# Altium schematic sheet BH67F2752_TEMP_EVM_V1.2.schdoc
size 304 x 228 mm; PageSetup: Record=PageOptions|CenterHorizontal=True|CenterVertical=True|PrintScale=0.87|XCorrection=1.00|YCorrection=1.00|PrintKind=1|BorderSize=5000000|LeftOffset=0|BottomOffset=0|Orientation=2|PaperLength=2970|PaperWidth=2100|Scale=100|PaperSource=7|PrintQuality=600|MediaType=1|DitherType=10|PaperKind=A4|PrintScaleMode=1
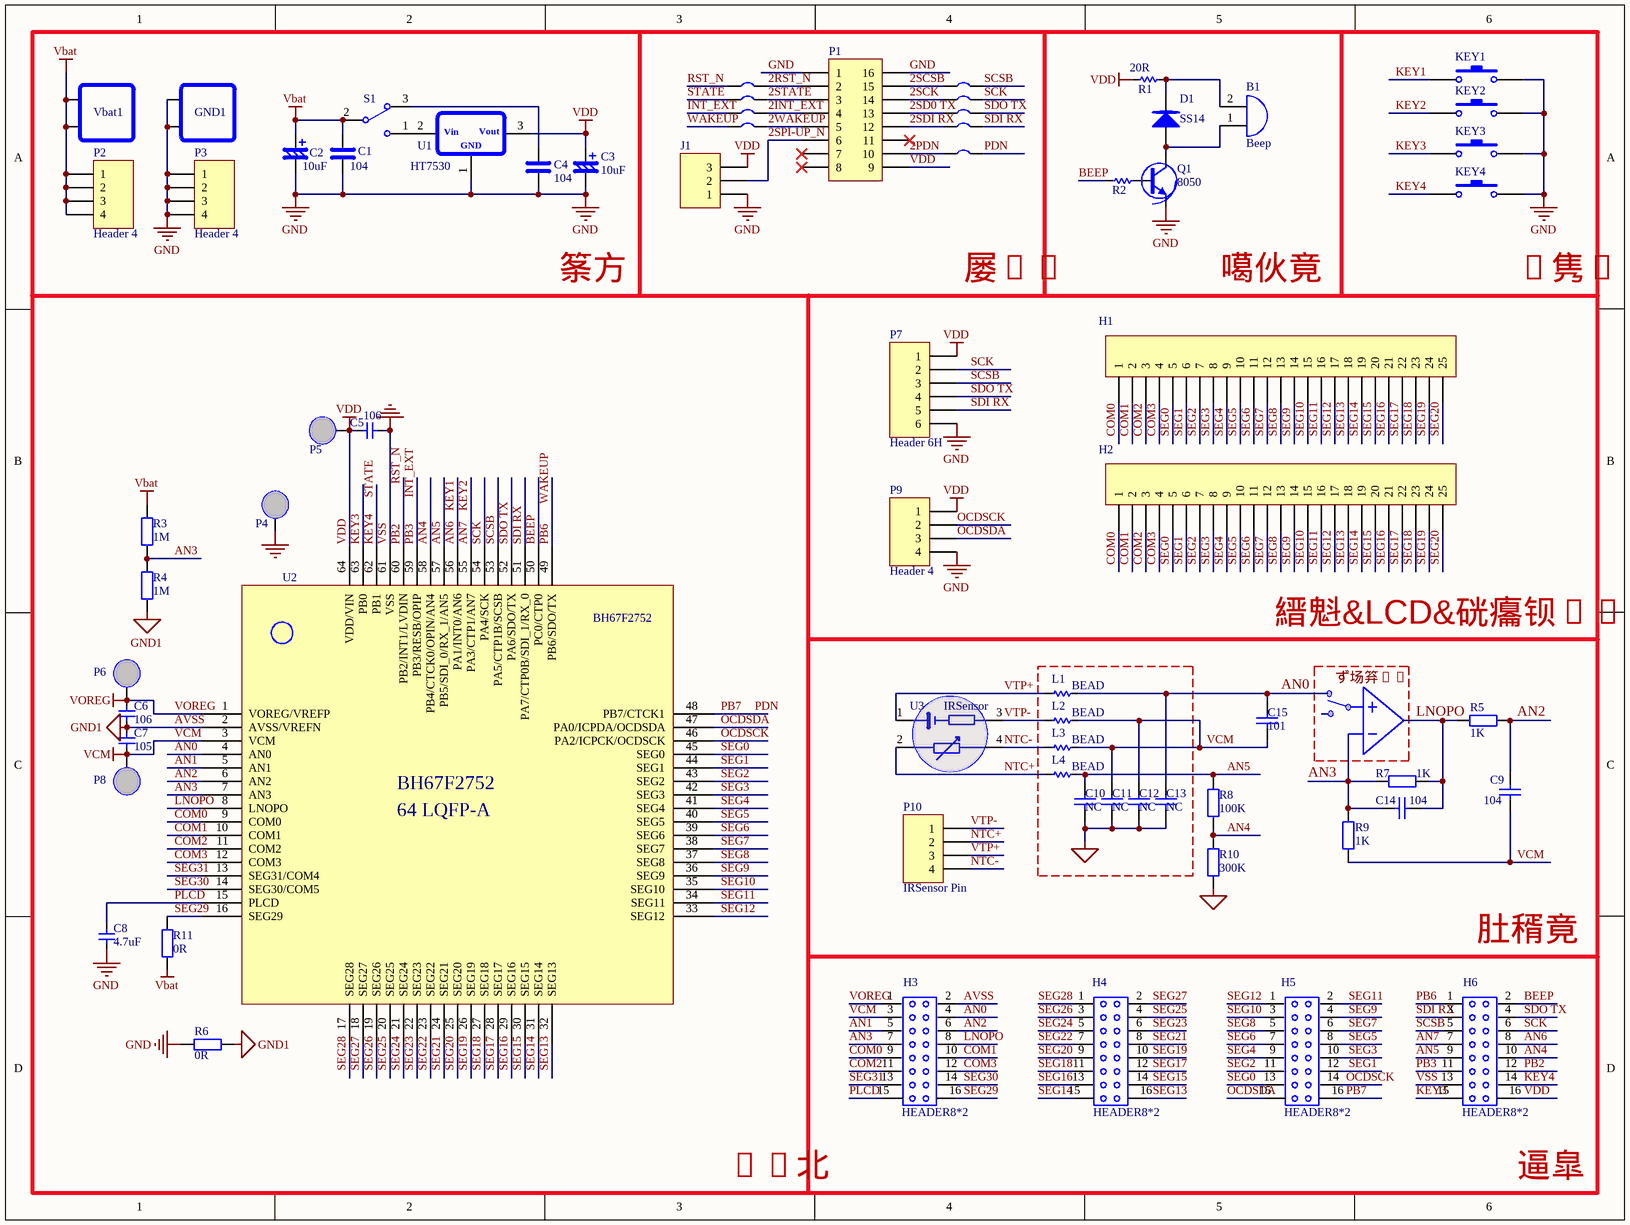
[diagram p0: BH67F2752_TEMP_EVM_V1.2.schdoc]

## Parts
B1  Beep  [BEEP_12mm]
C1  value 104  [C0805]  (hidden comment: CAPACITOR)
C2  Vaule: 10uF  [C0805]  (hidden comment: ECAP)
C3  Vaule: 10uF  [C0805]  (hidden comment: ECAP)
C4  value 104  [C0805]  (hidden comment: CAPACITOR)
C5  106  [CAP_0603]
C6  106  [CAP_0603]
C7  105  [CAP_0603]
C8  4.7uF  [CAP_0603]
C9  104  [CAP_0603]
C10  NC  [CAP_0603]
C11  NC  [CAP_0603]
C12  NC  [CAP_0603]
C13  NC  [CAP_0603]
C14  104  [CAP_0603]
C15  101  [CAP_0603]
D1  SS14  [DIODE]
GND1  CONNET*2  [CLIP POWER PIN]  (value not drawn)  (no BOM)
H1  HEADER36  [Header25(2mm) - duplicate]  (value not drawn)
H2  HEADER36  [Header252.54mm)]  (value not drawn)
H3  HEADER8*2  [HEAD2X8]  (no BOM)
H4  HEADER8*2  [2HEAD2X8]  (no BOM)
H5  HEADER8*2  [3HEAD2X8]  (no BOM)
H6  HEADER8*2  [4HEAD2X8 - duplicate]  (no BOM)
INT_EX1  JUMPER  [JUMP_2]  (value not drawn)  (no BOM)
J1  Header 3  [JUMP_3]  (value not drawn)
KEY1  SW-PB  [AN66]  (value not drawn)
KEY2  SW-PB  [AN66]  (value not drawn)
KEY3  SW-PB  [AN66]  (value not drawn)
KEY4  SW-PB  [AN66]  (value not drawn)
L1  BEAD  [RES_0603]
L2  BEAD  [RES_0603]
L3  BEAD  [RES_0603]
L4  BEAD  [RES_0603]
P1  Header 8X2A  [BC7602]  (value not drawn)
P2  Header 4  [HDR1X4]
P3  Header 4  [HDR1X4]
P4  PAD  [PAD]  (value not drawn)
P5  PAD  [PAD]  (value not drawn)
P6  PAD  [PAD]  (value not drawn)
P7  Header 6H  [HEAD1X6]
P8  PAD  [PAD]  (value not drawn)
P9  Header 4  [HDR1X4]
P10  IRSensor Pin  [HDR1X4]
PDN1  JUMPER  [JUMP_2]  (value not drawn)  (no BOM)
Q1  8050  [SOT-23]
R1  20R  [RES_0603]
R2  1K  [RES_0603]  (value not drawn)
R3  value 1M  [RES_0603]  (hidden comment: RES0603)
R4  value 1M  [RES_0603]  (hidden comment: RES0603)
R5  value 1K  [RES_0603]  (hidden comment: RES0603)
R6  value 0R  [RES_0603]  (hidden comment: RES0603)
R7  value 1K  [RES_0603]  (hidden comment: RES0603)
R8  value 100K  [RES_0603]  (hidden comment: RES0603)
R9  value 1K  [RES_0603]  (hidden comment: RES0603)
R10  value 300K  [RES_0603]  (hidden comment: RES0603)
R11  value 0R  [RES_0603]  (hidden comment: RES0603)
RST_N1  JUMPER  [JUMP_2]  (value not drawn)  (no BOM)
S1  SW-3  [JUMP_3]  (value not drawn)
SCK1  JUMPER  [JUMP_2]  (value not drawn)  (no BOM)
SCS1  JUMPER  [JUMP_2]  (value not drawn)  (no BOM)
SDIRX1  JUMPER  [JUMP_2]  (value not drawn)  (no BOM)
SDOTX1  JUMPER  [JUMP_2]  (value not drawn)  (no BOM)
STATE1  JUMPER  [JUMP_2]  (value not drawn)  (no BOM)
U1  HT7530  [SOT89M]
U2  BH67F2752  [64PIN(LQFP)]
U3  IRSensor  [TS318_115]
Vbat1  CONNET*2  [CLIP POWER PIN]  (value not drawn)  (no BOM)
WAKE1  JUMPER  [JUMP_2]  (value not drawn)  (no BOM)

## Nets
AVSS: C6.2 C7.1 C10.2 C11.2 C12.2 C13.2 H3.2 R4.2 R6.1 R10.2 U2.2(AVSS/VREFN)  [also labelled GND1]
GND: C1.1 C2.2 C3.2 C4.1 C5.1 C8.2 GND1.1 GND1.2 H6.13 J1.1 KEY1.2 KEY2.2 KEY3.2 KEY4.2 P1.1 P1.16 P3.1 P3.2 P3.3 P3.4 P4.1 P7.6 P9.4 Q1.2(E) R6.2 U1.1 U2.61(VSS)  [also labelled VSS]
Vbat: C1.2 C2.1 P2.1 P2.2 P2.3 P2.4 R3.1 S1.2 Vbat1.1 Vbat1.2
VCM: C7.2 C9.1 C11.1 C12.1 C15.2 H3.3 L2.2 L3.2 P8.1 R9.1 U2.3(VCM)
VDD: C3.1 C5.2 H6.16 J1.3 P1.9 P5.1 P7.1 P9.1 R1.2 U1.3 U2.64(VDD/VIN)
VOREG: C6.1 H3.1 P6.1 U2.1(VOREG/VREFP)
2INT_EXT: INT_EX1.2 P1.4
2PDN: P1.10 PDN1.2
2RST_N: P1.2 RST_N1.2
2SCK: P1.14 SCK1.2
2SCSB: P1.15 SCS1.2
2SD0 TX: P1.13 SDOTX1.2
2SDI RX: P1.12 SDIRX1.2
2SPI-UP_N: J1.2 P1.6
2STATE: P1.3 STATE1.2
2WAKEUP: P1.5 WAKE1.2
AN0: C13.1 C15.1 H3.4 L1.2 U2.4(AN0)
AN1: H3.5 U2.5(AN1)
AN2: C9.2 H3.6 R5.2 U2.6(AN2)
AN3: C14.2 H3.7 R3.2 R4.1 R7.1 R9.2 U2.7(AN3)
AN4: H6.10 R8.2 R10.1 U2.58(PB4/CTCK0/OPIN/AN4)
AN5: C10.1 H6.9 L4.2 R8.1 U2.57(PB5/SDI_0/RX_1/AN5)
AN6: H6.8 KEY1.1 U2.56(PA1/INT0/AN6)  [also labelled KEY1]
AN7: H6.7 KEY2.1 U2.55(PA3/CTP1/AN7)  [also labelled KEY2]
BEEP: H6.2 R2.1 U2.50(PC0/CTP0)
COM0: H1.1 H2.1 H3.9 U2.9(COM0)
COM1: H1.2 H2.2 H3.10 U2.10(COM1)
COM2: H1.3 H2.3 H3.11 U2.11(COM2)
COM3: H1.4 H2.4 H3.12 U2.12(COM3)
INT_EXT: H6.11 INT_EX1.1 U2.59(PB3/RESB/OPIP)  [also labelled PB3]
KEY3: H6.15 KEY3.1 U2.63(PB0)
KEY4: H6.14 KEY4.1 STATE1.1 U2.62(PB1)  [also labelled STATE]
LNOPO: C14.1 H3.8 R5.1 R7.2 U2.8(LNOPO)
NTC+: L4.1 P10.2 U3.2
NTC-: L3.1 P10.4 U3.4
OCDSCK: H5.14 P9.2 U2.46(PA2/ICPCK/OCDSCK)
OCDSDA: H5.15 P9.3 U2.47(PA0/ICPDA/OCDSDA)
PB2: H6.12 RST_N1.1 U2.60(PB2/INT1/LVDIN)  [also labelled RST_N]
PB6: H6.1 U2.49(PB6/SDO/TX) WAKE1.1  [also labelled WAKEUP]
PB7: H5.16 PDN1.1 U2.48(PB7/CTCK1)  [also labelled PDN]
PLCD: C8.1 H3.15 U2.15(PLCD)
SCK: H6.6 P7.2 SCK1.1 U2.54(PA4/SCK)
SCSB: H6.5 P7.3 SCS1.1 U2.53(PA5/CTP1B/SCSB)
SDI RX: H6.3 P7.5 SDIRX1.1 U2.51(PA7/CTP0B/SDI_1/RX_0)
SDO TX: H6.4 P7.4 SDOTX1.1 U2.52(PA6/SDO/TX)
SEG0: H1.5 H2.5 H5.13 U2.45(SEG0)
SEG1: H1.6 H2.6 H5.12 U2.44(SEG1)
SEG2: H1.7 H2.7 H5.11 U2.43(SEG2)
SEG3: H1.8 H2.8 H5.10 U2.42(SEG3)
SEG4: H1.9 H2.9 H5.9 U2.41(SEG4)
SEG5: H1.10 H2.10 H5.8 U2.40(SEG5)
SEG6: H1.11 H2.11 H5.7 U2.39(SEG6)
SEG7: H1.12 H2.12 H5.6 U2.38(SEG7)
SEG8: H1.13 H2.13 H5.5 U2.37(SEG8)
SEG9: H1.14 H2.14 H5.4 U2.36(SEG9)
SEG10: H1.15 H2.15 H5.3 U2.35(SEG10)
SEG11: H1.16 H2.16 H5.2 U2.34(SEG11)
SEG12: H1.17 H2.17 H5.1 U2.33(SEG12)
SEG13: H1.18 H2.18 H4.16 U2.32(SEG13)
SEG14: H1.19 H2.19 H4.15 U2.31(SEG14)
SEG15: H1.20 H2.20 H4.14 U2.30(SEG15)
SEG16: H1.21 H2.21 H4.13 U2.29(SEG16)
SEG17: H1.22 H2.22 H4.12 U2.28(SEG17)
SEG18: H1.23 H2.23 H4.11 U2.27(SEG18)
SEG19: H1.24 H2.24 H4.10 U2.26(SEG19)
SEG20: H1.25 H2.25 H4.9 U2.25(SEG20)
SEG21: H4.8 U2.24(SEG21)
SEG22: H4.7 U2.23(SEG22)
SEG23: H4.6 U2.22(SEG23)
SEG24: H4.5 U2.21(SEG24)
SEG25: H4.4 U2.20(SEG25)
SEG26: H4.3 U2.19(SEG26)
SEG27: H4.2 U2.18(SEG27)
SEG28: H4.1 U2.17(SEG28)
SEG29: H3.16 R11.2 U2.16(SEG29)
SEG30: H3.14 U2.14(SEG30/COM5)
SEG31: H3.13 U2.13(SEG31/COM4)
VTP+: L1.1 P10.3 U3.1
VTP-: L2.1 P10.1 U3.3
NetB1_1: B1.1 D1.1(A) Q1.3(C)
NetB1_2: B1.2 D1.2(K) R1.1
NetC4_2: C4.2 S1.3
NetQ1_1: Q1.1(B) R2.2
NetS1_1: S1.1 U1.2

Not connected (* = marked no-connect by the designer): P1 7* 8* 11*; R11 1

## Notes on the sheet
- 筿方
- 屡��
- 噶伙竟
- �隽�
- 縉魁&LCD&硄癟钡�f
- ず场笲��
- 肚稰竟
- �D北
- (near H6) 逼皐
- Labels drawn without touching a wire or pin: Vbat
- (in symbol BH67F2752) 64 LQFP-A
- (in symbol LDO) Vin; Vout; GND

## Library data of the parts
C2 C3 = ECAP: Capacitor
C5-C8 = CAP(1)
C9 C14 = Cap: Capacitor; Published: 8-Jun-2000; LatestRevisionDate: 17-Jul-2002; LatestRevisionNote: Re-released for DXP Platform.; PackageReference: RAD-0.3; Publisher: Altium Limited; PackageDescription: Radial Cap, Thru-Hole; 2 Leads; 0.3 in Pin Spacing; Value: 104
C10-C13 C15 = Cap: Capacitor; Value: 104; Published: 8-Jun-2000; LatestRevisionDate: 17-Jul-2002; LatestRevisionNote: Re-released for DXP Platform.; PackageReference: RAD-0.3; Publisher: Altium Limited; PackageDescription: Radial Cap, Thru-Hole; 2 Leads; 0.3 in Pin Spacing
D1 = DIODE(1)
GND1 Vbat1 = CONNET*2: 2CONNET*2.54
INT_EX1 PDN1 RST_N1 SCK1 SCS1 SDIRX1 SDOTX1 STATE1 WAKE1 = JUMPER2: JUMPER FOR BREAK CIRCUTS
J1 = Header 3: Header, 3-Pin; LatestRevisionDate: 17-Jul-2002; LatestRevisionNote: Re-released for DXP Platform.; Publisher: Altium Limited
KEY1-KEY4 = SW-PB: Switch; Published: 24-Mar-1999; LatestRevisionDate: 17-Jul-2002; LatestRevisionNote: Re-released for DXP Platform.; PackageReference: SPST-2; Publisher: Altium Limited; PackageDescription: Switch; 2 Leads
L1-L4 R1 R2 = RES(1)
P1 = Header 8X2A: Header, 8-Pin, Dual row; LatestRevisionDate: 17-Jul-2002; LatestRevisionNote: Re-released for DXP Platform.; Publisher: Altium Limited
P2 P3 P9 P10 = Header 4: Header, 4-Pin; LatestRevisionDate: 17-Jul-2002; LatestRevisionNote: Re-released for DXP Platform.; Publisher: Altium Limited
P7 = Header 6H: Header, 6-Pin, Right Angle; LatestRevisionDate: 17-Jul-2002; LatestRevisionNote: Re-released for DXP Platform.; Publisher: Altium Limited
Q1 = NPN(1)
R3-R11 = Res2: Resistor; Published: 8-Jun-2000; LatestRevisionDate: 17-Jul-2002; LatestRevisionNote: Re-released for DXP Platform.; PackageReference: 0603_R; Publisher: Altium Limited; PackageDescription: Axial Device, Thru-Hole; 2 Leads; 0.4 in Pin Spacing
U1 = LDO: Low Drop Regulator